# EAGLE schematic GOTEK Speaker Curcuit (EAGLE 9.6.1)
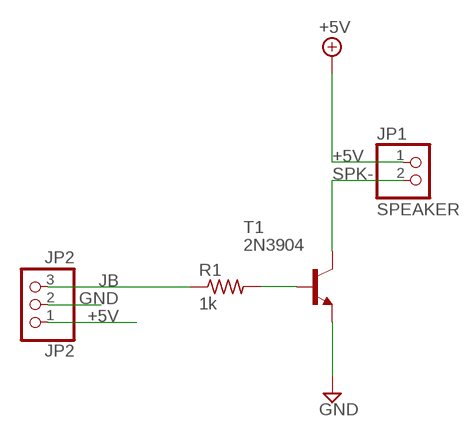
[diagram p0: schematic, sheet 1]

## Parts
JP1  SPEAKER  PINHD-1X2  [1X02]
JP2  JP2  PINHD-1X3  [1X03]
R1  1k  R-US_0204/7  [0204/7]
T1  2N3904  [TO92]

## Nets
+5V: JP1.1 JP2.1
GND: JP2.2 T1.3(E)
JB: JP2.3 R1.1
N$2: R1.2 T1.2(B)
SPK-: JP1.2 T1.1(C)

## Library data of the parts
JP1 = pinhead:PINHD-1X2: PIN HEADER
JP2 = pinhead:PINHD-1X3: PIN HEADER
R1 = rcl:R-US_: RESISTOR, American symbol; SPICEPREFIX: R
T1 = transistor:2N3904: NPN TRANSISTOR